# Altium schematic sheet 05.Miniport_Host.SchDoc
size A4; CheckedBy: <审核日期>; Author: 刘时杰; CompanyName: 广州致远电子有限公司; DocumentNumber: 5; SheetNumber: 5; SheetTotal: 8; PageSetup: Record=PageOptions|CenterHorizontal=True|CenterVertical=True|PrintScale=1.00|XCorrection=1.00|YCorrection=1.00|PrintKind=0|BorderSize=5000000|LeftOffset=0|BottomOffset=0|Orientation=2|PaperLength=1000|PaperWidth=1000|Scale=100|PaperSource=7|PrintQuality=600|MediaType=1|DitherType=10|PaperKind=A4|PrintScaleMode=1; DesignDate: 20180913; CheckDate: <审核人员>; SheetName: MiniPort接口; SheetVersion: V1.01; SheetDescription: MiniPort接口; productModel: AML166-Core; productName: AML166评估板
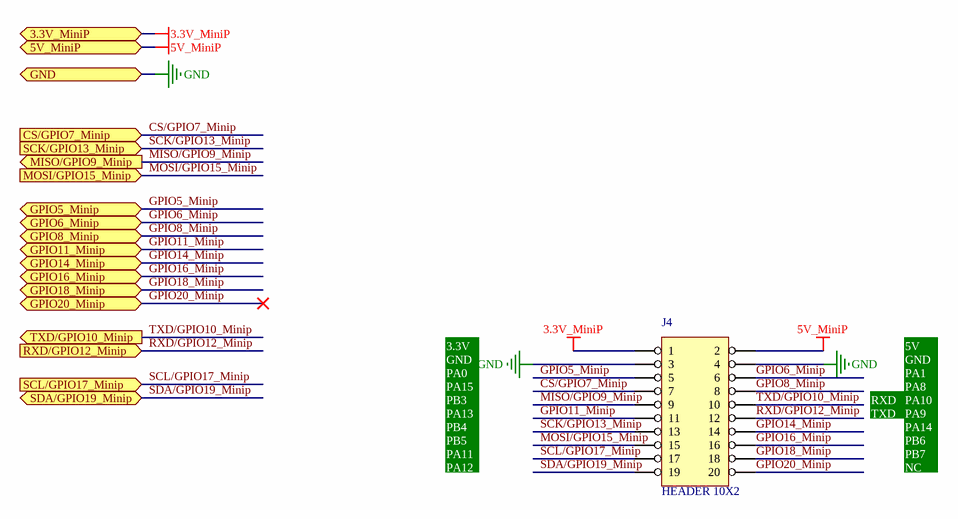
[diagram p0: 05.Miniport_Host.SchDoc]

## Parts
J4  HEADER 10X2  [IDC-20-2.54-R90]

## Ports
3.3V_MiniP, 5V_MiniP, CS/GPIO7_Minip (in), GND, GPIO5_Minip (bidir), GPIO6_Minip (bidir), GPIO8_Minip (bidir), GPIO11_Minip (bidir), GPIO14_Minip (bidir), GPIO16_Minip (bidir), GPIO18_Minip (bidir), GPIO20_Minip (bidir), MISO/GPIO9_Minip (out), MOSI/GPIO15_Minip (in), RXD/GPIO12_Minip (in), SCK/GPIO13_Minip (in), SCL/GPIO17_Minip (in), SDA/GPIO19_Minip (bidir), TXD/GPIO10_Minip (out)

## Nets
3.3V_MiniP: J4.1 ; port 3.3V_MiniP
5V_MiniP: J4.2 ; port 5V_MiniP
GND: J4.3 J4.4 ; port GND
CS/GPIO7_Minip: J4.7 ; port CS/GPIO7_Minip
GPIO5_Minip: J4.5 ; port GPIO5_Minip
GPIO6_Minip: J4.6 ; port GPIO6_Minip
GPIO8_Minip: J4.8 ; port GPIO8_Minip
GPIO11_Minip: J4.11 ; port GPIO11_Minip
GPIO14_Minip: J4.14 ; port GPIO14_Minip
GPIO16_Minip: J4.16 ; port GPIO16_Minip
GPIO18_Minip: J4.18 ; port GPIO18_Minip
GPIO20_Minip: J4.20 ; port GPIO20_Minip
MISO/GPIO9_Minip: J4.9 ; port MISO/GPIO9_Minip
MOSI/GPIO15_Minip: J4.15 ; port MOSI/GPIO15_Minip
RXD/GPIO12_Minip: J4.12 ; port RXD/GPIO12_Minip
SCK/GPIO13_Minip: J4.13 ; port SCK/GPIO13_Minip
SCL/GPIO17_Minip: J4.17 ; port SCL/GPIO17_Minip
SDA/GPIO19_Minip: J4.19 ; port SDA/GPIO19_Minip
TXD/GPIO10_Minip: J4.10 ; port TXD/GPIO10_Minip

## Notes on the sheet
- TXD
- RXD
- 3.3V
  GND
  PA0
  PA15
  PB3
  PA13
  PB4
  PB5
  PA11
  PA12
- 5V
  GND
  PA1
  PA8
  PA10
  PA9
  PA14
  PB6
  PB7
  NC
- 1
- #
- 修改日期
- 修改内容
- 2
- 3
- 设计人员
- 审核人员
- 设计日期
- 审核日期
- 产品名称
- 图纸名称
- 产品型号
- 图纸描述
- 图纸版本
- A4